# Altium project SMPS.PrjPcb
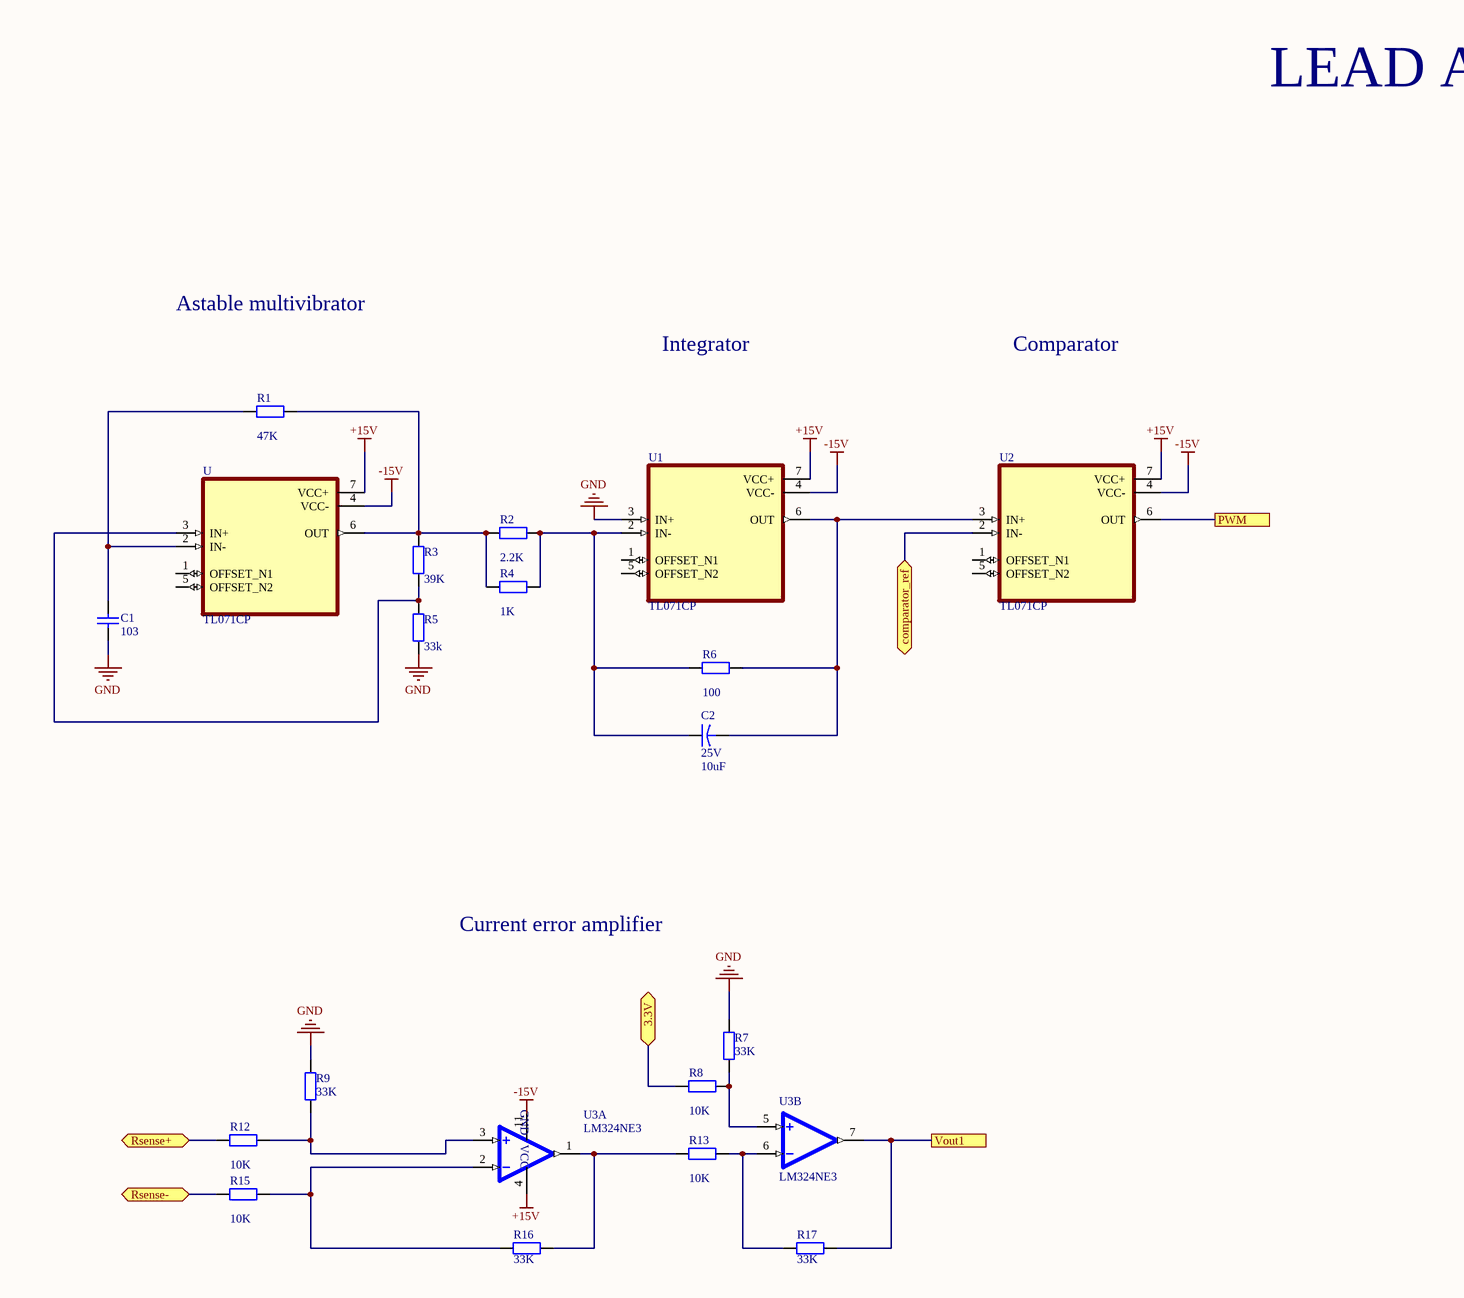
[diagram p0: Sheet1.SchDoc, top left]
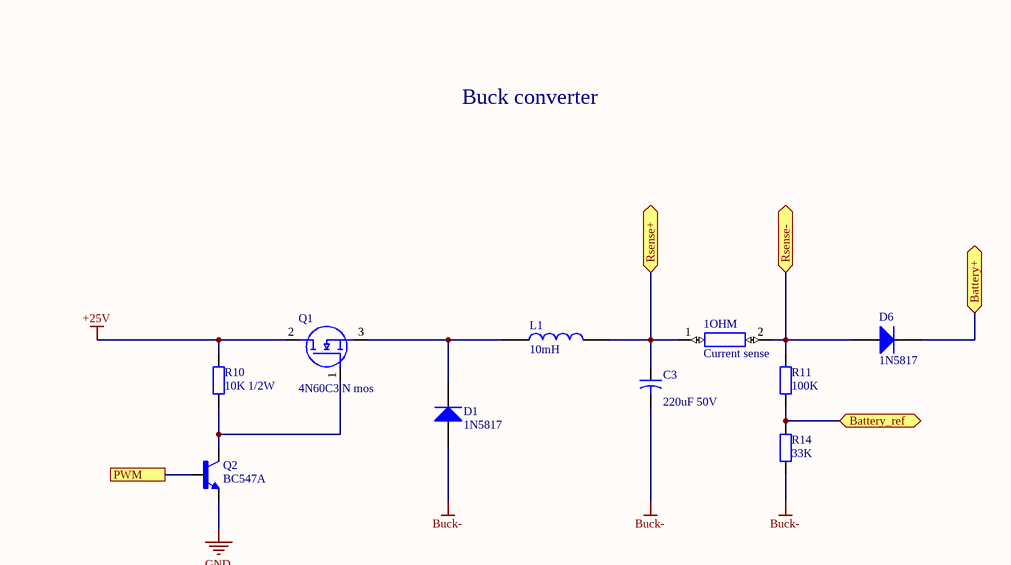
[diagram p1: Sheet1.SchDoc, top right]
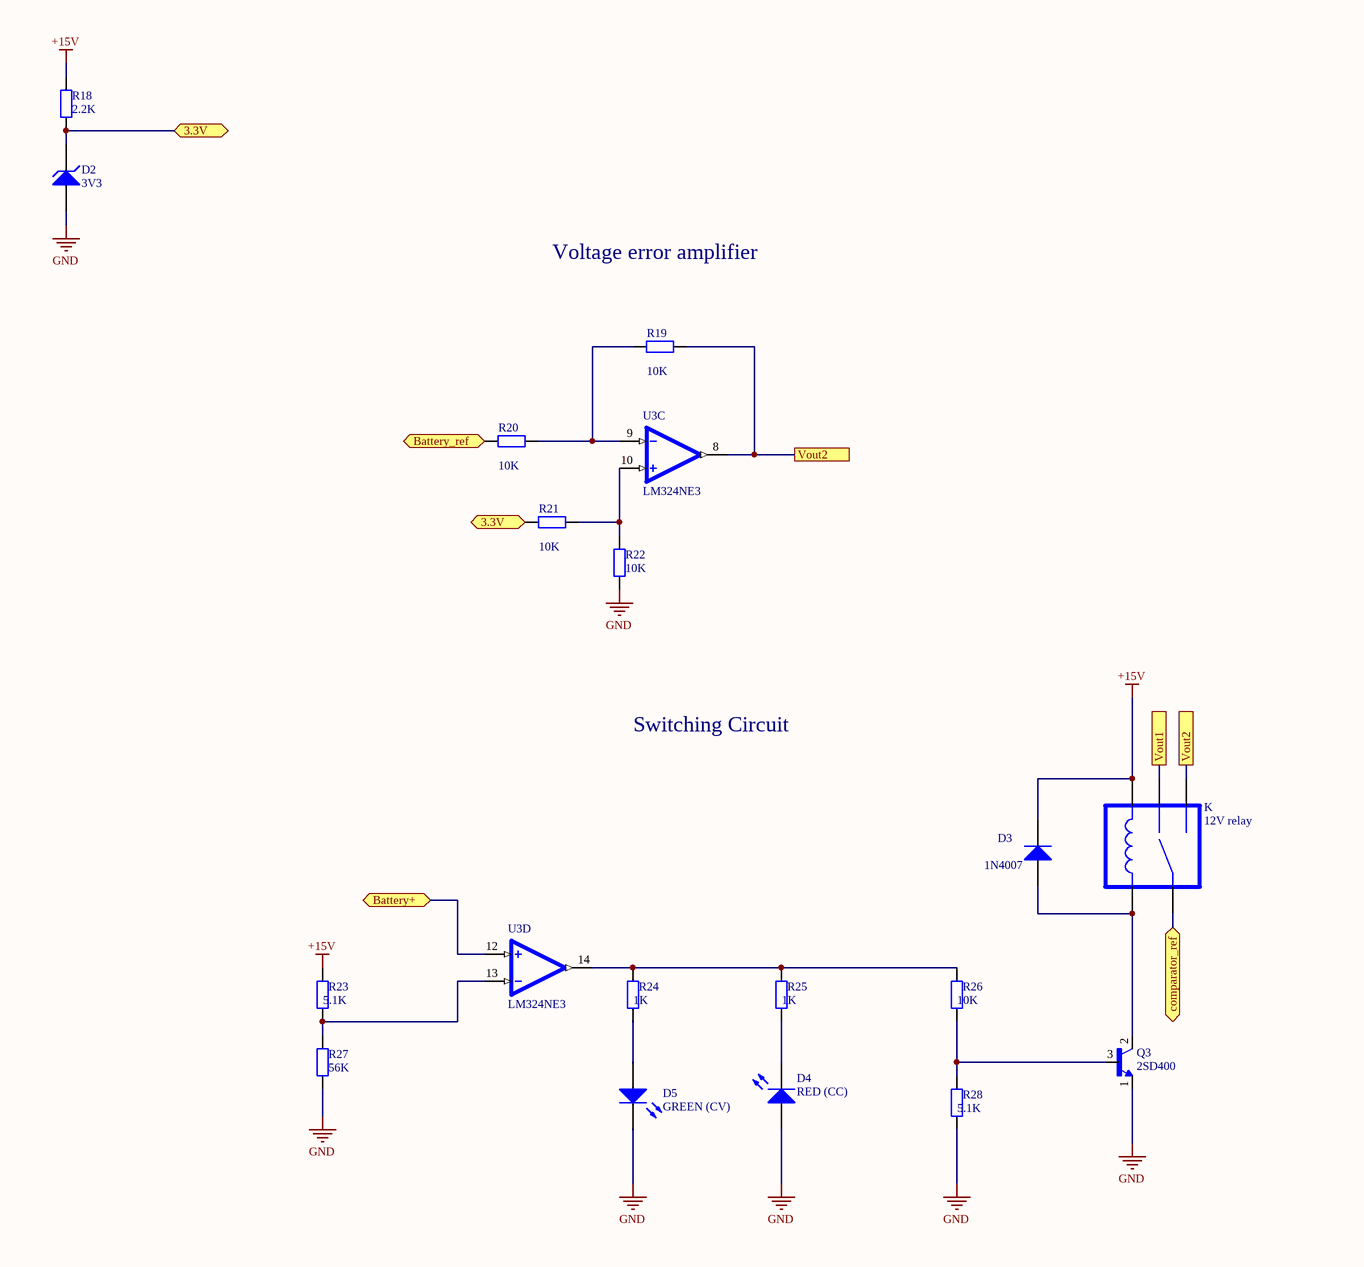
[diagram p2: Sheet1.SchDoc, bottom left]
1 sheet, 47 parts. Net scope: flat (ports and power ports of the same name join across sheets).
Board file: PCB1.PcbDoc

## Sheet Sheet1.SchDoc
size OrCAD D; SheetNumber: 1; SheetTotal: 1; SPICEModelCacheXSFJVCKC: <root> / <DocumentId>XSFJVCKC</DocumentId> / <CacheFrame Number="0"> / <Model Name="cap" Kind="MDL"> / <Text>*Default semiconductor capacitor / .MODEL CAP C()</Text> / </Model> / <Model Name="zener" Kind="MDL"> / <Text>*ZENER / *Default Zener 10V @ 10mA / *Zener Diode Pinout: A,K / .MODEL ZENER D( BV=10 IBV=10E-3 )</Text> / </Model> / <Model Name="led1" Kind="MDL"> / <Text>*Typ RED GaAs LED: Vf=1.7V Vr=4V If=40mA trr=3uS / *LED Pinout: 1=A, 2=K / .MODEL LED1 D (IS=93.2P RS=42M N=3.73 BV=4 IBV=10U / + CJO=2.97P VJ=.75 M=.333 TT=4.32U)</Text> / </Model> / <Model Name="1n4007" Kind="MDL"> / <Text>*1N4007 MCE 8-16-95 / *1000V 1A Si GenPurpose Diode pkg:DIODE0.4 1,2 / .MODEL 1N4007 D(IS=2.55E-9 RS=0.042 N=1.75 TT=5.76E-6 CJO=1.85E-11 / + VJ=0.75 M=0.333 BV=1000 IBV=9.86E-5 )</Text> / </Model> / </CacheFrame> / </root>

### Parts
1OHM  Current sense  [RESAD5860W102L2380D870]
C1  103  [RAD-0.3]
C2  25V  value 10uF  [CAPR5-4X5]
C3  value 220uF 50V  [CAPR5-4X5]  (hidden comment: Cap2)
D1  1N5817  [DO-41]
D2  3V3  [DIODE-0.7]
D3  1N4007  [DO-41]
D4  RED (CC)  [LED-1]
D5  GREEN (CV)  [LED-1]
D6  1N5817  [DO-41]
K  12V relay  [TE_1461069-5]
L1  10mH  [PE92102KNL]
Q1  4N60C3 N mos  [TO544P516X1586X2557-3P]
Q2  BC547A  [TO92250P510H770-3]
Q3  2SD400  [TO92250P510H770-3]
R1  value 47K  [AXIAL-0.4]  (hidden comment: Res2)
R2  value 2.2K  [AXIAL-0.4]  (hidden comment: Res2)
R3  value 39K  [AXIAL-0.4]  (hidden comment: Res2)
R4  value 1K  [AXIAL-0.4]  (hidden comment: Res2)
R5  value 33k  [AXIAL-0.4]  (hidden comment: Res2)
R6  value 100  [AXIAL-0.4]  (hidden comment: Res2)
R7  value 33K  [AXIAL-0.4]  (hidden comment: Res2)
R8  value 10K  [AXIAL-0.4]  (hidden comment: Res2)
R9  value 33K  [AXIAL-0.4]  (hidden comment: Res2)
R10  value 10K 1/2W  [AXIAL-0.4]  (hidden comment: Res2)
R11  value 100K  [AXIAL-0.4]  (hidden comment: Res2)
R12  value 10K  [AXIAL-0.4]  (hidden comment: Res2)
R13  value 10K  [AXIAL-0.4]  (hidden comment: Res2)
R14  value 33K  [AXIAL-0.4]  (hidden comment: Res2)
R15  value 10K  [AXIAL-0.4]  (hidden comment: Res2)
R16  value 33K  [AXIAL-0.4]  (hidden comment: Res2)
R17  value 33K  [AXIAL-0.4]  (hidden comment: Res2)
R18  value 2.2K  [AXIAL-0.4]  (hidden comment: Res2)
R19  value 10K  [AXIAL-0.4]  (hidden comment: Res2)
R20  value 10K  [AXIAL-0.4]  (hidden comment: Res2)
R21  value 10K  [AXIAL-0.4]  (hidden comment: Res2)
R22  value 10K  [AXIAL-0.4]  (hidden comment: Res2)
R23  value 5.1K  [AXIAL-0.4]  (hidden comment: Res2)
R24  value 1K  [AXIAL-0.4]  (hidden comment: Res2)
R25  value 1K  [AXIAL-0.4]  (hidden comment: Res2)
R26  value 10K  [AXIAL-0.4]  (hidden comment: Res2)
R27  value 56K  [AXIAL-0.4]  (hidden comment: Res2)
R28  value 5.1K  [AXIAL-0.4]  (hidden comment: Res2)
U  TL071CP  [DIP794W45P254L959H508Q8]
U1  TL071CP  [DIP794W45P254L959H508Q8]
U2  TL071CP  [DIP794W45P254L959H508Q8]
U3  LM324NE3  [DIP794W45P254L1969H508Q14]  (parts A,B,C,D of 4)

### Ports
3.3V (bidir), Battery+ (bidir), Battery_ref (bidir), comparator_ref (bidir), PWM, Rsense+ (bidir), Rsense- (bidir), Vout1, Vout2

### Nets
+15V: D3.2(K) K.5(M2) R18.2 R23.2 U.7(VCC+) U1.7(VCC+) U2.7(VCC+) U3.4(VCC)
+25V: Q1.2(D) R10.1
-15V: U.4(VCC-) U1.4(VCC-) U2.4(VCC-) U3.11(GND)
Buck-: C3.2 D1.1(A) R14.2
GND: C1.1 D2.1(A) D4.1(A) D5.2(K) Q2.3(E) Q3.1(E) R5.1 R7.1 R9.2 R22.1 R27.1 R28.1 U1.3(IN+)
Net1OHM_1: 1OHM.1 C3.1 L1.2 R12.1 ; port Rsense+
Net1OHM_2: 1OHM.2 D6.1(A) R11.1 R15.1 ; port Rsense-
NetC1_2: C1.2 R1.1 U.2(IN-)
NetC2_1: C2.1 R2.2 R4.2 R6.1 U1.2(IN-)
NetC2_2: C2.2 R6.2 U1.6(OUT) U2.3(IN+)
NetD1_2: D1.2(K) L1.1 Q1.3(S)
NetD2_2: D2.2(K) R8.1 R18.1 R21.1 ; port 3.3V
NetD3_1: D3.1(A) K.2(M1) Q3.2(C)
NetD4_2: D4.2(K) R25.1
NetD5_1: D5.1(A) R24.1
NetD6_2: D6.2(K) U3.12(4IN+) ; port Battery+
NetK_1: K.1(C) U2.2(IN-) ; port comparator_ref
NetK_3: K.3(NO) R19.2 U3.8(3OUT) ; port Vout2
NetK_4: K.4(NC) R17.1 U3.7(2OUT) ; port Vout1
NetQ1_1: Q1.1(G) Q2.1(C) R10.2
NetQ2_2: Q2.2(B) U2.6(OUT) ; port PWM
NetQ3_3: Q3.3(B) R26.1 R28.2
NetR1_2: R1.2 R2.1 R3.2 R4.1 U.6(OUT)
NetR3_1: R3.1 R5.2 U.3(IN+)
NetR7_2: R7.2 R8.2 U3.5(2IN+)
NetR9_1: R9.1 R12.2 U3.3(1IN+)
NetR11_2: R11.2 R14.1 R20.1 ; port Battery_ref
NetR13_1: R13.1 R16.1 U3.1(1OUT)
NetR13_2: R13.2 R17.2 U3.6(2IN-)
NetR15_2: R15.2 R16.2 U3.2(1IN-)
NetR19_1: R19.1 R20.2 U3.9(3IN-)
NetR21_2: R21.2 R22.2 U3.10(3IN+)
NetR23_1: R23.1 R27.2 U3.13(4IN-)
NetR24_2: R24.2 R25.2 R26.2 U3.14(4OUT)

Not connected (* = marked no-connect by the designer): U 1(OFFSET_N1) 5(OFFSET_N2); U1 1(OFFSET_N1) 5(OFFSET_N2); U2 1(OFFSET_N1) 5(OFFSET_N2)

### Notes on the sheet
- LEAD ACID BATTERY CHARGER
- Astable multivibrator
- Integrator
- Comparator
- Buck converter
- Current error amplifier
- Voltage error amplifier
- Switching Circuit

### Library data of the parts
1OHM = 45F25KE: 25 kOhms Â±1% 5W Through Hole Resistor Axial Wirewound; MF: Ohmite; Availability: In Stock; Price: None; Package: Axial Ohmite; SnapEDA_Link: https://www.snapeda.com/parts/45F25KE/Ohmite/view-part/5549197/?ref=snap; MP: 45F25KE; Value: *; Check_prices: https://www.snapeda.com/parts/45F25KE/Ohmite/view-part/5549197/?ref=eda; Purchase-URL: https://pricing.snapeda.com/search/part/45F25KE/?ref=eda
C1 = Cap: Capacitor; Published: 8-Jun-2000; LatestRevisionDate: 17-Jul-2002; LatestRevisionNote: Re-released for DXP Platform.; PackageReference: RAD-0.3; Publisher: Altium Limited; PackageDescription: Radial Cap, Thru-Hole; 2 Leads; 0.3 in Pin Spacing
C2 C3 = Cap2: Capacitor; Published: 23-Sep-2002; PackageReference: CAPR5-4X5; Publisher: Altium Limited; PackageDescription: Capacitor; 2 Leads
D1 D3 D6 = Diode 1N4007: 1 Amp General Purpose Rectifier; Published: 8-Jun-2000; LatestRevisionDate: 17-Jul-2002; LatestRevisionNote: Re-released for DXP Platform.; DatasheetVersion: 1998; PackageVersion: Aug-1999; PackageReference: DO-41; Publisher: Altium Limited; PackageDescription: Diode, Axial; Body 5.2 x 2.7 mm (LxDia. max), Lead Dia. 0.86 mm (max); Code_JEDEC: DO-204-AL; ComponentLink1Description: Manufacturer Link; ComponentLink1URL: http://www.fairchildsemi.com/; ComponentLink2Description: Datasheet; ComponentLink2URL: http://www.fairchildsemi.com/ds/1N%2F1N4001.pdf
D2 = D Zener: Zener Diode; Published: 8-Jun-2000; LatestRevisionDate: 17-Jul-2002; LatestRevisionNote: Re-released for DXP Platform.; PackageReference: DIODE-0.7; Publisher: Altium Limited; PackageDescription: Diode, Thru-Hole; 2 Leads; 0.7 in Pin Spacing
D4 D5 = LED1: Typical RED GaAs LED; Published: 8-Jun-2000; LatestRevisionDate: 08-Jul-2005; LatestRevisionNote: Mech Layer 1 removed.; PackageReference: LED-1; Publisher: Altium Limited; PackageDescription: LED; 2 Leads
K = 1461069-5: General Purpose Relay SPDT _1 Form C_ 12VDC Coil Through Hole; MF: TE Connectivity; Value: *; MP: 1461069-5; Package: None; SnapEDA_Link: https://www.snapeda.com/parts/1461069-5/TE%20Connectivity%20Potter%20%26%20Brumfield%20Relays/view-part/410849/?ref=snap; TE_purchase_URL: https://www.te.com/usa-en/product-1461069-5.html?te_bu=Cor&te_type=disp&te_campaign=seda_glo_cor-seda-global-disp-prtnr-fy19-seda-model-bom-cta_sma-317_1&elqCampaignId=32493; Price: None; Availability: Unavailable
L1 = PE-92102KNL: Pulse 100 uH +/-20% Leaded Inductor, 2.6A Idc, 100m Rdc; Geometry.Height: 21.59mm; Manufacturer_Name: Pulse; Manufacturer_Part_Number: PE-92102KNL; Mouser Part Number: 673-PE-92102KNL; Mouser Price/Stock: https://www.mouser.co.uk/ProductDetail/Pulse-Electronics/PE-92102KNL?qs=XfNjFG7P%252BGKs3THbSp7mZw%3D%3D; Arrow Part Number: PE-92102KNL; Arrow Price/Stock: https://www.arrow.com/en/products/pe-92102knl/pulse-electronics-corporation?region=europe; Mouser Testing Part Number: *; Mouser Testing Price/Stock: *; Datasheet Link: https://componentsearchengine.com/Datasheets/2/PE-92102KNL.pdf
Q1 = SPW24N60C3: Infineon SPW24N60C3 N-channel MOSFET Transistor, 24.3 A, 650 V, 3-Pin TO-247; Geometry.Height: 5.16mm; Manufacturer_Name: Infineon; Manufacturer_Part_Number: SPW24N60C3; Mouser Part Number: 726-SPW24N60C3; Mouser Price/Stock: https://www.mouser.co.uk/ProductDetail/Infineon-Technologies/SPW24N60C3?qs=OWKQh20chupSsK1UtjrB3Q%3D%3D; Arrow Part Number: *; Arrow Price/Stock: *; Mouser Testing Part Number: *; Mouser Testing Price/Stock: *; Datasheet Link: https://static.chipdip.ru/lib/046/DOC003046521.pdf
Q2 = BC547A: Bipolar (BJT) Transistor NPN 45 V 100 mA 300MHz 625 mW Through Hole TO-92 (TO-226); MF: ON Semiconductor; Price: None; MP: BC547A; Purchase-URL: https://pricing.snapeda.com/search/part/BC547A/?ref=eda; Package: E-PKG AXIAL-LEADED-2 ON Semiconductor; Check_prices: https://www.snapeda.com/parts/BC547A/Onsemi/view-part/?ref=eda; SnapEDA_Link: https://www.snapeda.com/parts/BC547A/Onsemi/view-part/?ref=snap; Value: *; Availability: In Stock
Q3 = 2SD400: TO-92MOD Transistor (NPN). Low-Frequency Power Amp, Electronic Governor Applications.; MF: LGE; Value: *; SnapEDA_Link: https://www.snapeda.com/parts/2SD400/LGE/view-part/?ref=snap; MP: 2SD400; Check_prices: https://www.snapeda.com/parts/2SD400/LGE/view-part/?ref=eda; Availability: Not in stock; Price: None; Package: TO-92 Sanyo
R1-R28 = Res2: Resistor; Published: 8-Jun-2000; LatestRevisionDate: 17-Jul-2002; LatestRevisionNote: Re-released for DXP Platform.; PackageReference: AXIAL-0.4; Publisher: Altium Limited; PackageDescription: Axial Device, Thru-Hole; 2 Leads; 0.4 in Pin Spacing
U U1 U2 = TL071CP: Low-Noise JFET-Input General-Purpose Operational Amplifier 8-PDIP 0 to 70; MF: Texas Instruments; Package: PDIP-8 Texas Instruments; Value: *; Price: None; Availability: Warning; Texas_Instruments-Purchase-URL: https://snapeda.com/shop?store=Texas+Instruments&id=52481; MP: TL071CP; DigiKey-Purchase-URL: https://snapeda.com/shop?store=DigiKey&id=52481; SnapEDA_Link: https://www.snapeda.com/parts/TL071CP/Texas%20Instruments/view-part/52481/?ref=snap; Mouser-Purchase-URL: https://snapeda.com/shop?store=Mouser&id=52481
U3 = LM324NE3: Quad, 30-V, 1.2-MHz operational amplifier; MF: Texas Instruments; SnapEDA_Link: https://www.snapeda.com/parts/LM324NE3/Texas+Instruments/view-part/?ref=snap; Package: PDIP-14 Texas Instruments; MP: LM324NE3; Check_prices: https://www.snapeda.com/parts/LM324NE3/Texas+Instruments/view-part/?ref=eda; Purchase-URL: https://pricing.snapeda.com/search/part/LM324NE3/?ref=eda; Price: None; Value: *; Availability: In Stock